# Altium project khoahoc.PrjPcb
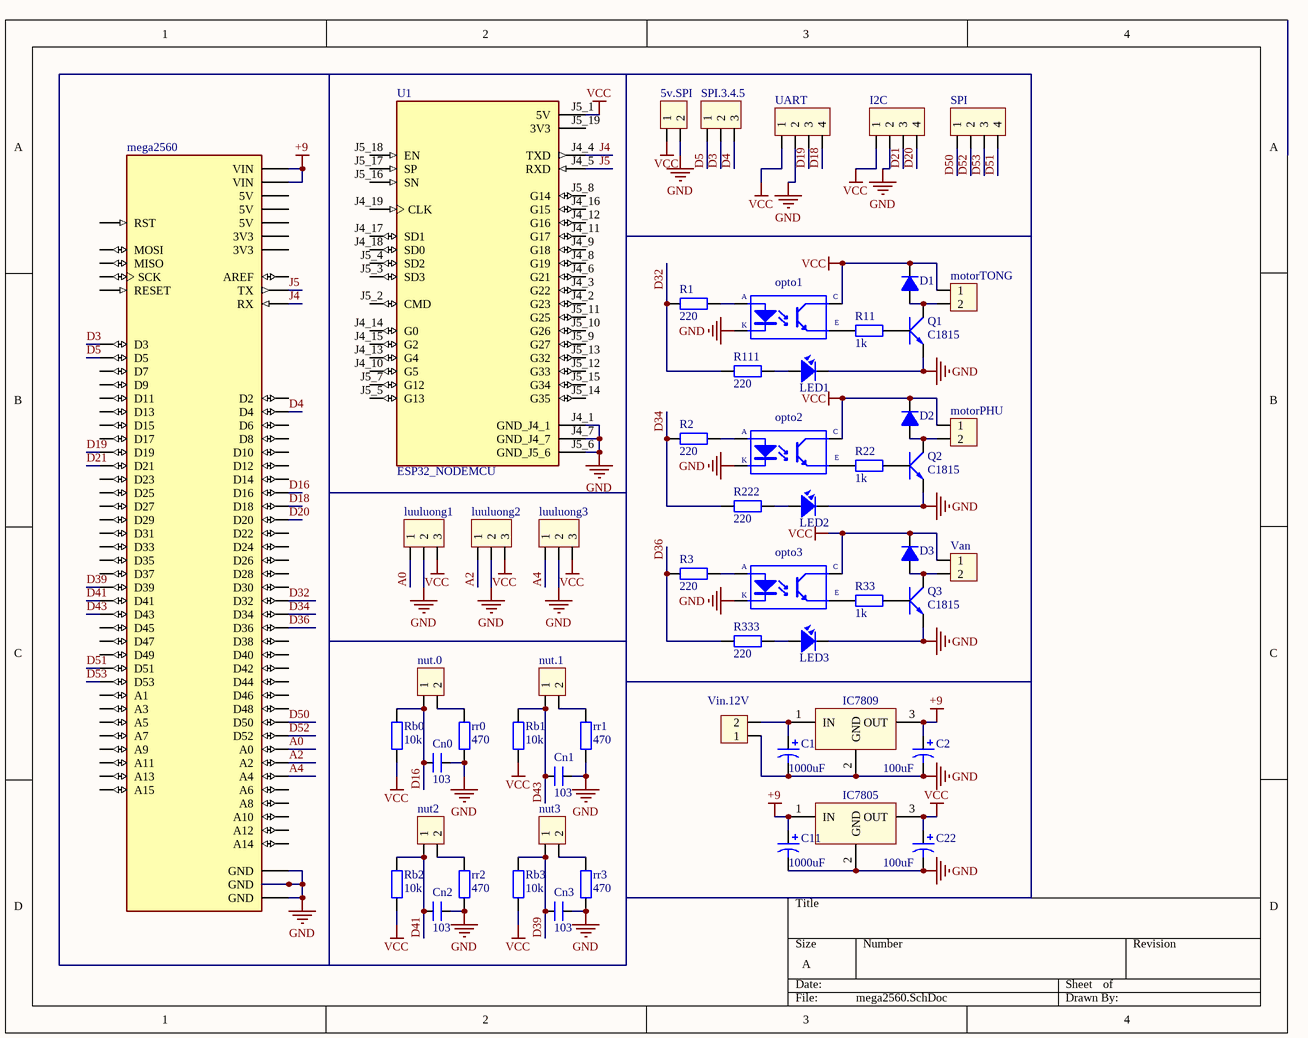
[diagram p0: mega2560.SchDoc]
1 sheet, 57 parts. Net scope: global (net labels, ports and power ports of the same name join across sheets).
Board file: Mega2560_ESP32.PcbDoc

## Sheet mega2560.SchDoc
size A

### Parts
5v.SPI  (no value)  [HED2]
C1  value 1000uF  [CP2/5]
C2  value 100uF  [CP2/5]
C11  value 1000uF  [CP2/5]
C22  value 100uF  [CP2/5]
Cn0  103  [CN1.5]
Cn1  103  [CN1.5]
Cn2  103  [CN1.5]
Cn3  103  [CN1.5]
D1  (no value)  [D5A]
D2  (no value)  [D5A]
D3  (no value)  [D5A]
I2C  (no value)  [HED4]
IC7805  (no value)  [QTO-220]
IC7809  (no value)  [QTO-220]
LED1  LED  [LED-3]  (value not drawn)
LED2  LED  [LED-3]  (value not drawn)
LED3  LED  [LED-3]  (value not drawn)
luuluong1  (no value)  [HED3]
luuluong2  (no value)  [HED3]
luuluong3  (no value)  [HED3]
mega2560  (no value)  [MODULE_MEGA_PRO_EMBED_CH340G_/_ATMEGA2560]
motorPHU  (no value)  [HED2]
motorTONG  (no value)  [HED2]
nut2  (no value)  [HED2]
nut3  (no value)  [HED2]
nut.0  (no value)  [HED2]
nut.1  (no value)  [HED2]
opto1  (no value)  [OPTO_U]
opto2  (no value)  [OPTO_U]
opto3  (no value)  [OPTO_U]
Q1  C1815  [QTO-92]
Q2  C1815  [QTO-92]
Q3  C1815  [QTO-92]
R1  220  [R1/4W]
R2  220  [R1/4W]
R3  220  [R1/4W]
R11  1k  [R1/4W]
R22  1k  [R1/4W]
R33  1k  [R1/4W]
R111  220  [R1/4W]
R222  220  [R1/4W]
R333  220  [R1/4W]
Rb0  10k  [R1/4W]
Rb1  10k  [R1/4W]
Rb2  10k  [R1/4W]
Rb3  10k  [R1/4W]
rr0  470  [R1/4W]
rr1  470  [R1/4W]
rr2  470  [R1/4W]
rr3  470  [R1/4W]
SPI  (no value)  [HED4]
SPI.3.4.5  (no value)  [HED3]
U1  ESP32_NODEMCU  [MODULE_ESP32_NODEMCU]
UART  (no value)  [HED4]
Van  (no value)  [HED2]
Vin.12V  (no value)  [HED2]

### Nets
+9: C2.1 C11.1 IC7805.1(IN) IC7809.3(OUT) mega2560.VIN_1(VIN) mega2560.VIN_2(VIN)
GND: 5v.SPI.2 C1.2 C2.2 C11.2 C22.2 Cn0.1 Cn1.1 Cn2.1 Cn3.1 I2C.2 IC7805.2(GND) IC7809.2(GND) LED1.2 LED2.2 LED3.2 luuluong1.2 luuluong2.2 luuluong3.2 mega2560.GND_1(GND) mega2560.GND_2(GND) mega2560.GND_3(GND) opto1.K opto2.K opto3.K Q1.1(E) Q2.1(E) Q3.1(E) rr0.2 rr1.2 rr2.2 rr3.2 U1.J4_1(GND_J4_1) U1.J4_7(GND_J4_7) U1.J5_6(GND_J5_6) UART.2 Vin.12V.1
VCC: 5v.SPI.1 C22.1 D1.2(K) D2.2(K) D3.2(K) I2C.1 IC7805.3(OUT) luuluong1.3 luuluong2.3 luuluong3.3 motorPHU.1 motorTONG.1 opto1.C opto2.C opto3.C Rb0.2 Rb1.2 Rb2.2 Rb3.2 U1.J5_1(5V) UART.1 Van.1
A0: luuluong1.1 mega2560.A0
A2: luuluong2.1 mega2560.A2
A4: luuluong3.1 mega2560.A4
D3: mega2560.D3 SPI.3.4.5.2
D4: mega2560.D4 SPI.3.4.5.3
D5: mega2560.D5 SPI.3.4.5.1
D16: Cn0.2 mega2560.D16 nut.0.1 Rb0.1
D18: mega2560.D18 UART.4
D19: mega2560.D19 UART.3
D20: I2C.4 mega2560.D20
D21: I2C.3 mega2560.D21
D32: mega2560.D32 R1.1 R111.1
D34: mega2560.D34 R2.1 R222.1
D36: mega2560.D36 R3.2 R333.1
D39: Cn3.2 mega2560.D39 nut3.1 Rb3.1
D41: Cn2.2 mega2560.D41 nut2.1 Rb2.1
D43: Cn1.2 mega2560.D43 nut.1.1 Rb1.1
D50: mega2560.D50 SPI.1
D51: mega2560.D51 SPI.4
D52: mega2560.D52 SPI.2
D53: mega2560.D53 SPI.3
J4: mega2560.RX U1.J4_4(TXD)
J5: mega2560.TX U1.J4_5(RXD)
NetC1_1: C1.1 IC7809.1(IN) Vin.12V.2
NetD1_1: D1.1(A) motorTONG.2 Q1.2(C)
NetD2_1: D2.1(A) motorPHU.2 Q2.2(C)
NetD3_1: D3.1(A) Q3.2(C) Van.2
NetLED1_1: LED1.1 R111.2
NetLED2_1: LED2.1 R222.2
NetLED3_1: LED3.1 R333.2
Netnut2_2: nut2.2 rr2.1
Netnut3_2: nut3.2 rr3.1
Netnut.0_2: nut.0.2 rr0.1
Netnut.1_2: nut.1.2 rr1.1
Netopto1_A: opto1.A R1.2
Netopto1_E: opto1.E R11.1
Netopto2_A: opto2.A R2.2
Netopto2_E: opto2.E R22.1
Netopto3_A: opto3.A R3.1
Netopto3_E: opto3.E R33.1
NetQ1_3: Q1.3(B) R11.2
NetQ2_3: Q2.3(B) R22.2
NetQ3_3: Q3.3(B) R33.2

Not connected (* = marked no-connect by the designer): mega2560 3V3_1(3V3) 3V3_2(3V3) 5V_1(5V) 5V_2(5V) 5V_3(5V) A1 A3 A5 A6 A7 A8 A9 A10 A11 A12 A13 A14 A15 AREF D2 D6 D7 D8 D9 D10 D11 D12 D13 D14 D15 D17 D22 D23 D24 D25 D26 D27 D28 D29 D30 D31 D33 D35 D37 D38 D40 D42 D44 D45 D46 D47 D48 D49 MISO MOSI RESET RST SCK; U1 J4_2(G23) J4_3(G22) J4_6(G21) J4_8(G19) J4_9(G18) J4_10(G5) J4_11(G17) J4_12(G16) J4_13(G4) J4_14(G0) J4_15(G2) J4_16(G15) J4_17(SD1) J4_18(SD0) J4_19(CLK) J5_2(CMD) J5_3(SD3) J5_4(SD2) J5_5(G13) J5_7(G12) J5_8(G14) J5_9(G27) J5_10(G26) J5_11(G25) J5_12(G33) J5_13(G32) J5_14(G35) J5_15(G34) J5_16(SN) J5_17(SP) J5_18(EN) J5_19(3V3)

### Library data of the parts
5v.SPI motorPHU motorTONG nut2 nut3 nut.0 nut.1 Van Vin.12V = Hed2: Header 2 (Green); Value: Header 2
C1 C2 C11 C22 = Cap Pol3: Polarized Capacitor (Surface Mount); VALUE: C?; LatestRevisionDate: 17-Jul-2002; LatestRevisionNote: Re-released for DXP Platform.; PackageReference: C0805; Publisher: Altium Limited
Cn0-Cn3 = CN1.5: Cap np 682pF => 104pF; Value: 0.01uF
D1-D3 = D5A: Diode 5A; Value: 1N5408
I2C SPI UART = Hed4: Header 4 (Green); Value: Header 4
IC7805 IC7809 = LM78xx: On ap +, from + 5 to + 24VDC; Value: LM7805
LED1-LED3 = LED: LED Single colour Green and Red; Value: LED 3 ly Single Colour
luuluong1-luuluong3 SPI.3.4.5 = Hed3: Header 3 (Green); Value: Header 3
mega2560 = MEGA_PRO_EMBED_CH340G_/_ATMEGA2560: Mega 2560 PRO (Embed) CH340G/ATmega2560-16AU; Price: None; Value: *; MP: MEGA_PRO_EMBED_CH340G_/_ATMEGA2560; Package: None; Availability: Unavailable
opto1-opto3 = OPTO_U: Single Opto; Value: TLP5211
Q1-Q3 = C1815: NPN 600mW, ECB; Value: C1815
R1-R3 R11 R22 R33 R111 R222 R333 Rb0-Rb3 rr0-rr3 = R1/4W: Resistor 1/4W; Value: R1/4W - 1K
U1 = ESP32_NODEMCU: NodeMCU is an open source loT platform. ESP32 is a series of low cost, low powersystem-on-chip (SoC) microcontrollers with integrated Wi-Fi & dual-mode Bluetooth.; MF: Espressif Systems; MP: ESP32 NODEMCU; SnapEDA_Link: https://www.snapeda.com/parts/ESP32%20NODEMCU/Espressif+Systems/view-part/?ref=snap; Package: Package; Value: *; Check_prices: https://www.snapeda.com/parts/ESP32%20NODEMCU/Espressif+Systems/view-part/?ref=eda